# Altium schematic sheet Schematic.SchDoc
size A4; SheetNumber: 1; SheetTotal: 3
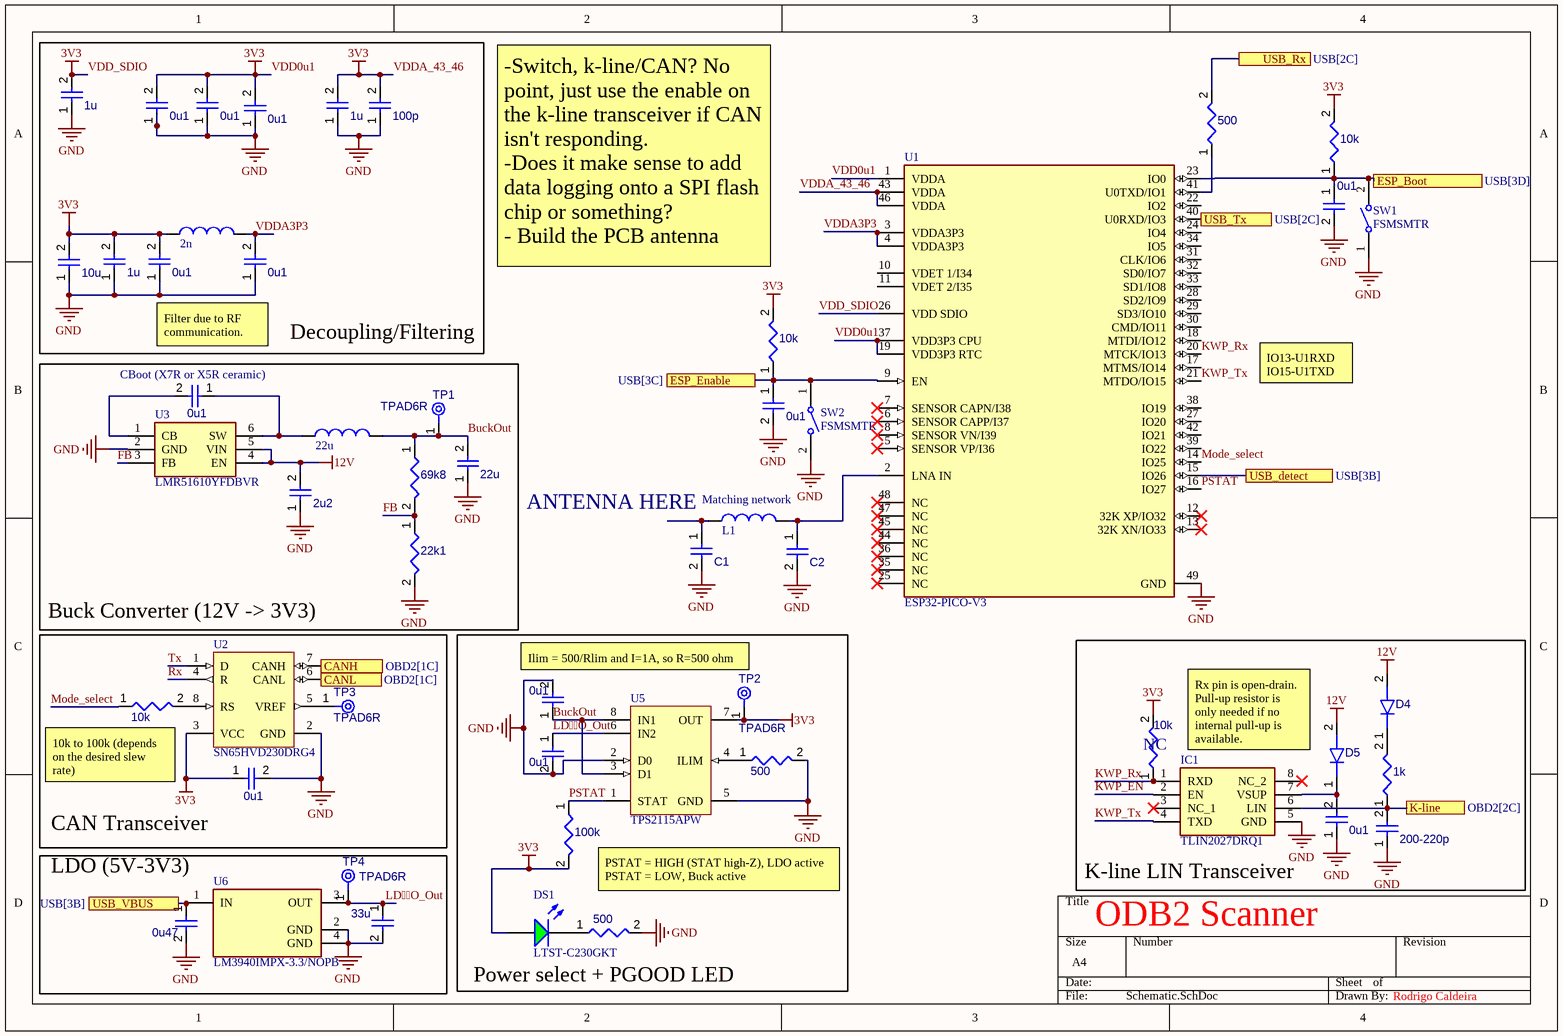
[diagram p0: Schematic.SchDoc]

## Parts
(Parts that share a designator on the sheet are numbered #1, #2 ... from top to bottom, then left to right.)
0u1#1  Capacitors  (value not drawn)
0u1#2  Capacitors  (value not drawn)
0u1#3  Capacitors  (value not drawn)
0u1#4  Capacitors  (value not drawn)
0u1#5  Capacitors  (value not drawn)
0u1#6  Capacitors  (value not drawn)
0u1#7  Capacitors  (value not drawn)
0u1#8  Capacitors  (value not drawn)
0u1#9  Capacitors  (value not drawn)
0u1#10  Capacitors  (value not drawn)
0u1#11  Capacitors  (value not drawn)
0u1#12  Capacitors  (value not drawn)
0u47  Capacitors  (value not drawn)
1k  Resistors  (value not drawn)
1u#1  Capacitors  (value not drawn)
1u#2  Capacitors  (value not drawn)
1u#3  Capacitors  (value not drawn)
2n  Inductors  (value not drawn)
2u2  Capacitors  (value not drawn)
10k#1  Resistors  (value not drawn)
10k#2  Resistors  (value not drawn)
10k#3  Resistors  (value not drawn)
10k#4  Resistors  (value not drawn)
10u  Capacitors  (value not drawn)
22k1  Resistors  (value not drawn)
22u#1  Inductors  (value not drawn)
22u#2  Capacitors  (value not drawn)
33u  Capacitors  (value not drawn)
69k8  Resistors  (value not drawn)
100k  Resistors  (value not drawn)
100p  Capacitors  (value not drawn)
200-220p  Capacitors  (value not drawn)
500#1  Resistors  (value not drawn)
500#2  Resistors  (value not drawn)
500#3  Resistors  (value not drawn)
C1  Capacitors  (value not drawn)
C2  Capacitors  (value not drawn)
D4  Diodes  (value not drawn)
D5  Diodes  (value not drawn)
DS1  LTST-C230GKT  [LTST-C230KGKT_V]
IC1  TLIN2027DRQ1  [SOIC127P600X175-8N]
L1  Inductors  (value not drawn)
SW1  FSMSMTR  [TECO-FSMSMTR_V]
SW2  FSMSMTR  [TECO-FSMSMTR_V]
TP1  TPAD6R  [TP06R]  (no BOM)
TP2  TPAD6R  [TP06R]  (no BOM)
TP3  TPAD6R  [TP06R]  (no BOM)
TP4  TPAD6R  [TP06R]  (no BOM)
U1  ESP32-PICO-V3  [FP-ESP32-PICO-V3-MFG]
U2  SN65HVD230DRG4  [D8_N]
U3  LMR51610YFDBVR  [SOT95P280X145-6N]
U5  TPS2115APW  [PW0008A_M]
U6  LM3940IMPX-3.3/NOPB  [FP-DCY0004A-MFG]

## Blocks framed on the sheet
Decoupling/Filtering: 0u1#1-0u1#3 0u1#5 0u1#6 1u#1-1u#3 2n 10u 100p
Power select + PGOOD LED: 0u1#9 0u1#10 100k 500#2 500#3 DS1 TP2 U5
K-line LIN Transceiver: 0u1#12 1k 10k#4 200-220p D4 D5 IC1

## Ports
CANH (see OBD2[1C]), CANL (see OBD2[1C]), ESP_Boot (see USB[3D]), ESP_Enable (see USB[3C]), K-line (see OBD2[2C]), USB_detect (see USB[3B]), USB_Rx (see USB[2C]), USB_Tx (see USB[2C]), USB_VBUS (see USB[3B])

## Nets
12V: 2u2.2 D4.2(A) D5.2(A) U3.4(EN) U3.5(VIN)
GND: 0u1#1.1 0u1#2.1 0u1#3.1 0u1#4.2 0u1#5.1 0u1#6.1 0u1#7.2 0u1#9.2 0u1#10.2 0u1#11.2 0u1#12.1 0u47.2 1u#1.1 1u#2.1 1u#3.1 2u2.1 10u.1 22k1.2 22u#2.1 33u.2 100p.1 200-220p.1 500#2.2 500#3.2 C1.2 C2.2 IC1.5(GND) SW1.1 SW2.2 U1.49(GND) U2.2(GND) U3.2(GND) U5.2(D0) U5.5(GND) U6.2(GND) U6.4(GND)
VDD0u1: 0u1#1.2 0u1#2.2 0u1#3.2 0u1#5.2 0u1#11.1 1u#1.2 1u#2.2 1u#3.2 2n.1 10k#1.2 10k#2.2 10k#4.2 10u.2 100k.2 100p.2 DS1.1(A) TP2.1(TP) U1.1(VDDA) U1.19(VDD3P3_RTC) U1.26(VDD_SDIO) U1.37(VDD3P3_CPU) U1.43(VDDA) U1.46(VDDA) U2.3(VCC) U5.7(OUT)  [also labelled 3V3, VDD_SDIO, VDDA_43_46]
BuckOut: 0u1#9.1 22u#1.2 22u#2.2 69k8.1 TP1.1(TP) U5.3(D1) U5.8(IN1)
CANH: U2.7(CANH) ; port CANH
CANL: U2.6(CANL) ; port CANL
ESP_Boot: 0u1#4.1 10k#1.1 SW1.2 U1.23(IO0) ; port ESP_Boot
ESP_Enable: 0u1#7.1 10k#2.1 SW2.1 U1.9(EN) ; port ESP_Enable
FB: 22k1.1 69k8.2 U3.3(FB)
K-line: 1k.1 200-220p.2 IC1.6(LIN) ; port K-line
KWP_EN: IC1.2(EN)
KWP_Rx: 10k#4.1 IC1.1(RXD) U1.20(MTCK/IO13)
KWP_Tx: IC1.4(TXD) U1.21(MTDO/IO15)
LDO_Out: 0u1#10.1 33u.1 TP4.1(TP) U5.6(IN2) U6.3(OUT)
Mode_select: 10k#3.1 U1.14(IO25)
PSTAT: 100k.1 U1.16(IO27) U5.1(STAT)
Rx: U2.4(R)
Tx: U2.1(D)
USB_detect: U1.15(IO26) ; port USB_detect
USB_Rx: 500#1.2 ; port USB_Rx
USB_Tx: U1.40(U0RXD/IO3) ; port USB_Tx
USB_VBUS: 0u47.1 U6.1(IN) ; port USB_VBUS
VDDA3P3: 0u1#6.2 2n.2 U1.3(VDDA3P3) U1.4(VDDA3P3)
Net0u1#8_1: 0u1#8.1 22u#1.1 U3.6(SW)
Net0u1#8_2: 0u1#8.2 U3.1(CB)
Net0u1#12_2: 0u1#12.2 D5.1(K) IC1.7(VSUP)
Net1k_2: 1k.2 D4.1(K)
Net10k#3_2: 10k#3.2 U2.8(RS)
Net500#1_1: 500#1.1 U1.41(U0TXD/IO1)
Net500#2_1: 500#2.1 U5.4(ILIM)
Net500#3_1: 500#3.1 DS1.2(K)
NetC1_1: C1.1 L1.1
NetC2_1: C2.1 L1.2 U1.2(LNA_IN)
NetTP3_1: TP3.1(TP) U2.5(VREF)

Not connected (* = marked no-connect by the designer): IC1 3(NC_1)* 8(NC_2)*; U1 5(SENSOR_VP/I36)* 6(SENSOR_CAPP/I37)* 7(SENSOR_CAPN/I38)* 8(SENSOR_VN/I39)* 10(VDET_1/I34) 11(VDET_2/I35) 12(32K_XP/IO32)* 13(32K_XN/IO33)* 17(MTMS/IO14) 18(MTDI/IO12) 22(IO2) 24(IO4) 25(NC)* 27(IO20) 28(SD2/IO9) 29(SD3/IO10) 30(CMD/IO11) 31(CLK/IO6) 32(SD0/IO7) 33(SD1/IO8) 34(IO5) 35(NC)* 36(NC)* 38(IO19) 39(IO22) 42(IO21) 44(NC)* 45(NC)* 47(NC)* 48(NC)*

## Notes on the sheet
- -Switch, k-line/CAN? No point, just use the enable on the k-line transceiver if CAN isn't responding.
  -Does it make sense to add data logging onto a SPI flash chip or something?
  - Build the PCB antenna
- (near 0u1#8) CBoot (X7R or X5R ceramic)
- (near 0u1#6) Filter due to RF communication.
- IO13-U1RXD
  IO15-U1TXD
- ANTENNA HERE
- (near L1) Matching network
- (near U2) Buck Converter (12V -> 3V3)
- Ilim = 500/Rlim and I=1A, so R=500 ohm
- (near 10k#3) 10k to 100k (depends on the desired slew rate)
- (near 10k#4) NC
- Rx pin is open-drain. Pull-up resistor is only needed if no internal pull-up is available.
- CAN Transceiver
- LDO (5V-3V3)
- PSTAT = HIGH (STAT high-Z), LDO active
  PSTAT = LOW, Buck active
- ODB2 Scanner
- Rodrigo Caldeira

## Library data of the parts
0u1#1-0u1#12 0u47 1u#1-1u#3 2u2 22u#2 33u 100p 200-220p C1 C2 = Capacitors: Capacitor; Component Type: Capacitors
1k 10k#1-10k#4 22k1 69k8 100k 500#1-500#3 = Resistors: Resistor; Component Type: Resistors
10u = Capacitors: Polarized Electrolitic Capacitor; Component Type: Capacitors
D4 D5 = Diodes: Diode; Component Type: Diodes
DS1 = CMP-2000-06625-1: LED Green, 75 mW, 30 mA, -30 to 85 degC, 2-Pin SMD, RoHS, Tape and Reel; Manufacturer: Lite-On; Product Length (mm): 3.2mm; Type: Uni-Color; Peak Wavelength: 574nm; Shape Type: Rectangular; DELETED: Compliant; Lum Intensity: 35mcd; Forward Voltage: 2.4V; High Brightness: Yes; Rad Hardened: No; Power Dissipation: 75W; Forward Current: 30mA; Emitting Color: YellowGreen; Main Category: ChipLED; Product Height (mm): 1.1mm; Product Depth (mm): 1.6mm; Number of  Elements: 1; Viewing Angle: 130deg; Chip Material: AlGaInP; Dominant Wave Length: 571nm; Test Current (It): 20mA; Reverse Voltage: 5V; Mounting: SurfaceMount; Datasheet URL: http://optoelectronics.liteon.com/upload/download/DS22-2000-256/S_110_LTST-C230KGKT.pdf; Luminous Intensity: 35mcd; Pin Count: 2; Mounting Technology: SurfaceMount; Operating Temperature Classification: Industrial; Operating Temp Range: -55Cto85C; Package Type: ChipLed; Manufacturer URL: http://www.us.liteon.com/; Package Description: 2-Pin Surface Mount Device, Body 3.2 x 1.6 mm; Package Reference: C230KGKT; Datasheet Version: Rev. G, 12/2014; Lens Dimensions: 1.5X1.6X0.82mm; Packaging: TapeandReel
IC1 = TLIN2027DRQ1: Integrated Circuit; Manufacturer_Name: Texas Instruments; Datasheet Link: https://www.arrow.com/en/products/tlin2027drq1/texas-instruments; Height: 1.75mm; Manufacturer_Part_Number: TLIN2027DRQ1; Mouser Part Number: 595-TLIN2027DRQ1; Mouser Price/Stock: https://www.mouser.co.uk/ProductDetail/Texas-Instruments/TLIN2027DRQ1?qs=81r%252BiQLm7BR5Em8N%252BNvRQg%3D%3D; Arrow Part Number: TLIN2027DRQ1; Arrow Price/Stock: https://www.arrow.com/en/products/tlin2027drq1/texas-instruments?region=nac
SW1 SW2 = CMP-2000-07501-1: FSMSM Push Button Switch, 50 mA, -35 to 85 degC, 2-Pin SMD, RoHS, Tape and Reel; Manufacturer: TE Connectivity; Voltage Rating (DC): 24V; Electrical Life: 20000Cycles; Operating Force: 180gf; Switch Travel: 0.25mm; Contact Current Rating: 50mA; Case\/Package: SMD/SMT; Actuator Length: 1.07mm; Throw Configuration: SPST; Actuator Material: Polyamide; Contact Resistance: 100mOhm; Illumination Type: Illuminated; Max Voltage Rating (DC): 12V; Manufacturer URL: http://www.te.com/; Lead Free: LeadFree; Packaging: TapeandReel; Min Operating Temperature: -35degC; Mechanical Life: 20000Cycles; Mount: SurfaceMount; REACH SVHC: Unknown; Package Quantity: 1800; Package Reference: FSMSMTR; RoHSCompliant: true; Max Operating Temperature: 85degC; Orientation: Straight; ELV: Compliant; Datasheet URL: http://www.te.com/commerce/DocumentDelivery/DDEController?Action=showdoc&DocId=Customer+Drawing%7F1437566-3%7FC2%7Fpdf%7FEnglish%7FENG_CD_1437566-3_C2_1437566_3_1_c.dwg.pdf%7F1437566-4; Package Description: 2-Pin Surface Mount Device, Body 6 x 3.5 mm, Pitch 9.19 mm; Current Rating: 50mA; Contact Plating: Silver; Termination: GullWing; Datasheet Version: Rev. C2, 08/2014; Contact Material: Brass; Mounting Technology: SurfaceMount
TP1-TP4 = CMP-00028-00002-2: 0.6mm round; Pins: 1
U1 = CMP-194065-000030-1: RX TXRX MOD WIFI SURFACE MOUNT
U2 = CMP-0315-00017-1: 3.3 V CAN Transceiver with Standby Mode, 17 mA, -40 to 85 degC, 8-pin SOIC (D), Green (RoHS & no Sb/Br); Manufacturer: Texas Instruments; Receivers Per Package: 1; Rating: Catalog; Transient Pulse Protection(V): -25 to 25; Supply Voltage(s)(V): 3.3; ICC(Max)(mA): 17; Code_JEDEC: MS-012AA; PackageVersion: revM, Jun-2011; Eco-Plan: Green (RoHS & no Sb/Br); SubFamily: CAN; ComponentLink1Description: Datasheet; Footprint: PCA82C250; PackageReference: D8; PartNumber: SN65HVD230DRG4; DatasheetVersion: SLOS346K; Mounting Technology: Surface Mount; ComponentLink1URL: http://www.ti.com/general/docs/lit/getliterature.tsp?genericPartNumber=SN65HVD230&fileType=pdf; Isolated: No; Drivers Per Package: 1; PackageDescription: 8-Pin Plastic Small Outline Integrated Circuit, 4.9 x 3.9 mm, Pitch 1.27 mm Pitch; Low Power Mode: Standby
U3 = LMR51610YFDBVR: Integrated Circuit; Manufacturer_Name: Texas Instruments; Datasheet Link: https://www.ti.com/lit/ds/symlink/lmr51610.pdf?ts=1727151330338&ref_url=https%253A%252F%252Fwww.mouser.in%252F; Height: 1.45mm; Manufacturer_Part_Number: LMR51610YFDBVR; Mouser Part Number: 595-LMR51610YFDBVR; Mouser Price/Stock: https://www.mouser.co.uk/ProductDetail/Texas-Instruments/LMR51610YFDBVR?qs=dbcCsuKDzFWbILGJVHCR7g%3D%3D; Arrow Part Number: LMR51610YFDBVR; Arrow Price/Stock: https://www.arrow.com/en/products/lmr51610yfdbvr/texas-instruments?utm_currency=USD&region=nac
U5 = CMP-0339-00017-2: Dual In / Single Out Autoswitching Power Mux, 2.8 to 5.5 V, -40 to 85 degC, 8-pin TSSOP (PW), Green (RoHS & no Sb/Br); Manufacturer: Texas Instruments; Number of Inputs: 2; IN1, IN2 Input Voltage(Min)(V): 2.8; IN1 Output Current(Max)(A): 1.25; SubFamily: Power Multiplexer (MUX); IN1, IN2 Input Voltage(Max)(V): 5.5; IN1 rDS(on)(Typ)(mOhm): 84; IN2 rDS(on)(Typ)(Ohms): 0.084; ComponentLink1URL: http://www.ti.com/general/docs/lit/getliterature.tsp?genericPartNumber=TPS2115A&fileType=pdf; Code_JEDEC: MO-153; Eco-Plan: Green (RoHS & no Sb/Br); PackageVersion: revG, Feb-2011; PartNumber: TPS2115APW; DatasheetVersion: SBVS044F; PackageDescription: 8-Pin Plastic Thin Small Outline Package 3 x 4.4 mm Body ,0.65 mm Pitch; Mounting Technology: Surface Mount; ComponentLink1Description: Datasheet; PackageReference: PW0008A; IN2 Output Current(Max)(A): 1.25
U6 = CMP-04917-000180-1: IC REG LINEAR 3.3V 1A SOT223-4; Polarity: Positive; Dropout Voltage: 500mV; Number of Regulators: 1; Min Input Voltage: 4.5V; Quiescent Current: 15mA; Output Type: Fixed; Max Input Voltage: 7.5V; Packaging: Tape and Reel; Mount: Surface Mount; Number of Pins: 4; Package Quantity: 2000; Output Current: 1A; Min Operating Temperature: -40°C; Contact Plating: Tin; Max Output Current: 1A; Radiation Hardening: No; Output Voltage: 3.3V; Lead Free: Lead Free; Case/Package: SOT-223; Number of Outputs: 1; Max Operating Temperature: 125°C; RoHS Compliant: Yes
2n 22u#1 L1 = Inductors: Component Type: Inductors